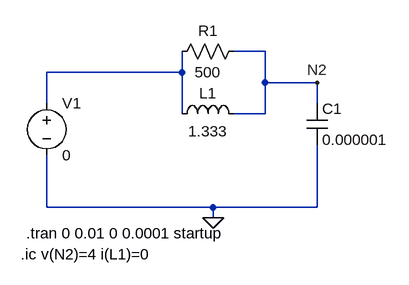
[diagram p0: schematic project 2 q21 .asc]
project 2 q21 .asc, the LTspice schematic file:
Version 4
SHEET 1 880 680
WIRE 384 64 336 64
WIRE 256 96 256 64
WIRE 256 96 48 96
WIRE 384 112 384 64
WIRE 464 112 384 112
WIRE 48 144 48 96
WIRE 464 144 464 112
WIRE 256 160 256 96
WIRE 384 160 384 112
WIRE 384 160 336 160
WIRE 48 304 48 224
WIRE 304 304 48 304
WIRE 464 304 464 208
WIRE 464 304 304 304
WIRE 304 320 304 304
FLAG 304 320 0
FLAG 464 112 N2
SYMBOL voltage 48 128 R0
WINDOW 123 0 0 Left 0
WINDOW 39 0 0 Left 0
SYMATTR InstName V1
SYMATTR Value 0
SYMBOL res 352 48 R90
WINDOW 0 0 56 VBottom 0
WINDOW 3 32 56 VTop 0
SYMATTR InstName R1
SYMATTR Value 500
SYMBOL cap 448 144 R0
SYMATTR InstName C1
SYMATTR Value 0.000001
SYMBOL ind 240 176 R270
WINDOW 0 32 56 VTop 0
WINDOW 3 5 56 VBottom 0
SYMATTR InstName L1
SYMATTR Value 1.333
TEXT 16 344 Left 0 !.tran 0 0.01 0 0.0001 startup
TEXT 8 376 Left 0 !.ic v(N2)=4 i(L1)=0

The netlist it stands for:
* project 2 q21 .asc
V1 N001 0 0
R1 N2 N001 500
C1 N2 0 0.000001
L1 N001 N2 1.333
.tran 0 0.01 0 0.0001 startup
.ic v(N2)=4 i(L1)=0
.backanno
.end